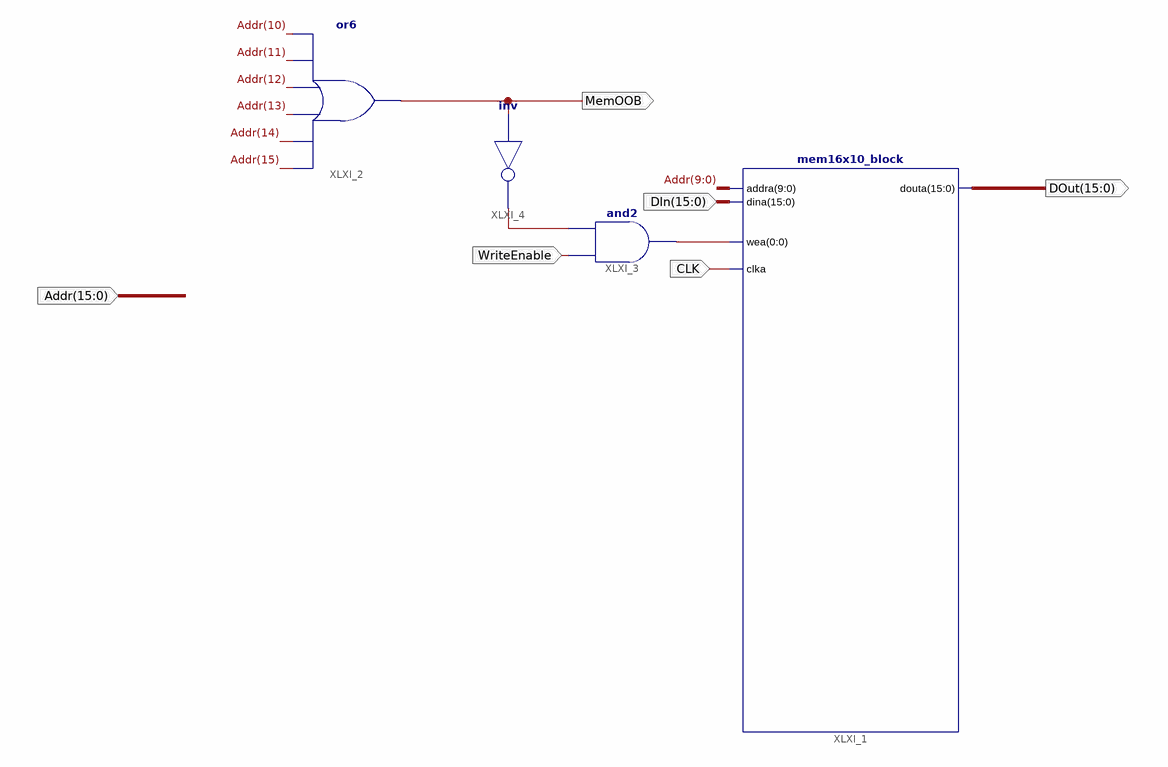
[diagram p0: schematic sheet 1]
// Xilinx ISE schematic memWrapper.sch (spartan3e) as structural Verilog: 4 symbols, 6 ports
module memWrapper (
  input  [15:0] Addr,
  input  [15:0] DIn,
  input  CLK,
  input  WriteEnable,
  output [15:0] DOut,
  output MemOOB
);

  wire XLXN_15;
  wire [0:0] XLXN_6;

  mem16x10_block XLXI_1 (.addra(Addr[9:0]), .dina(DIn), .wea(XLXN_6[0]), .clka(CLK), .douta(DOut));
  or XLXI_2 (MemOOB, Addr[15], Addr[14], Addr[13], Addr[12], Addr[11], Addr[10]);
  and XLXI_3 (XLXN_6[0], WriteEnable, XLXN_15);
  not XLXI_4 (XLXN_15, MemOOB);
endmodule
